# EAGLE design layer2 (EAGLE 9.6.2)
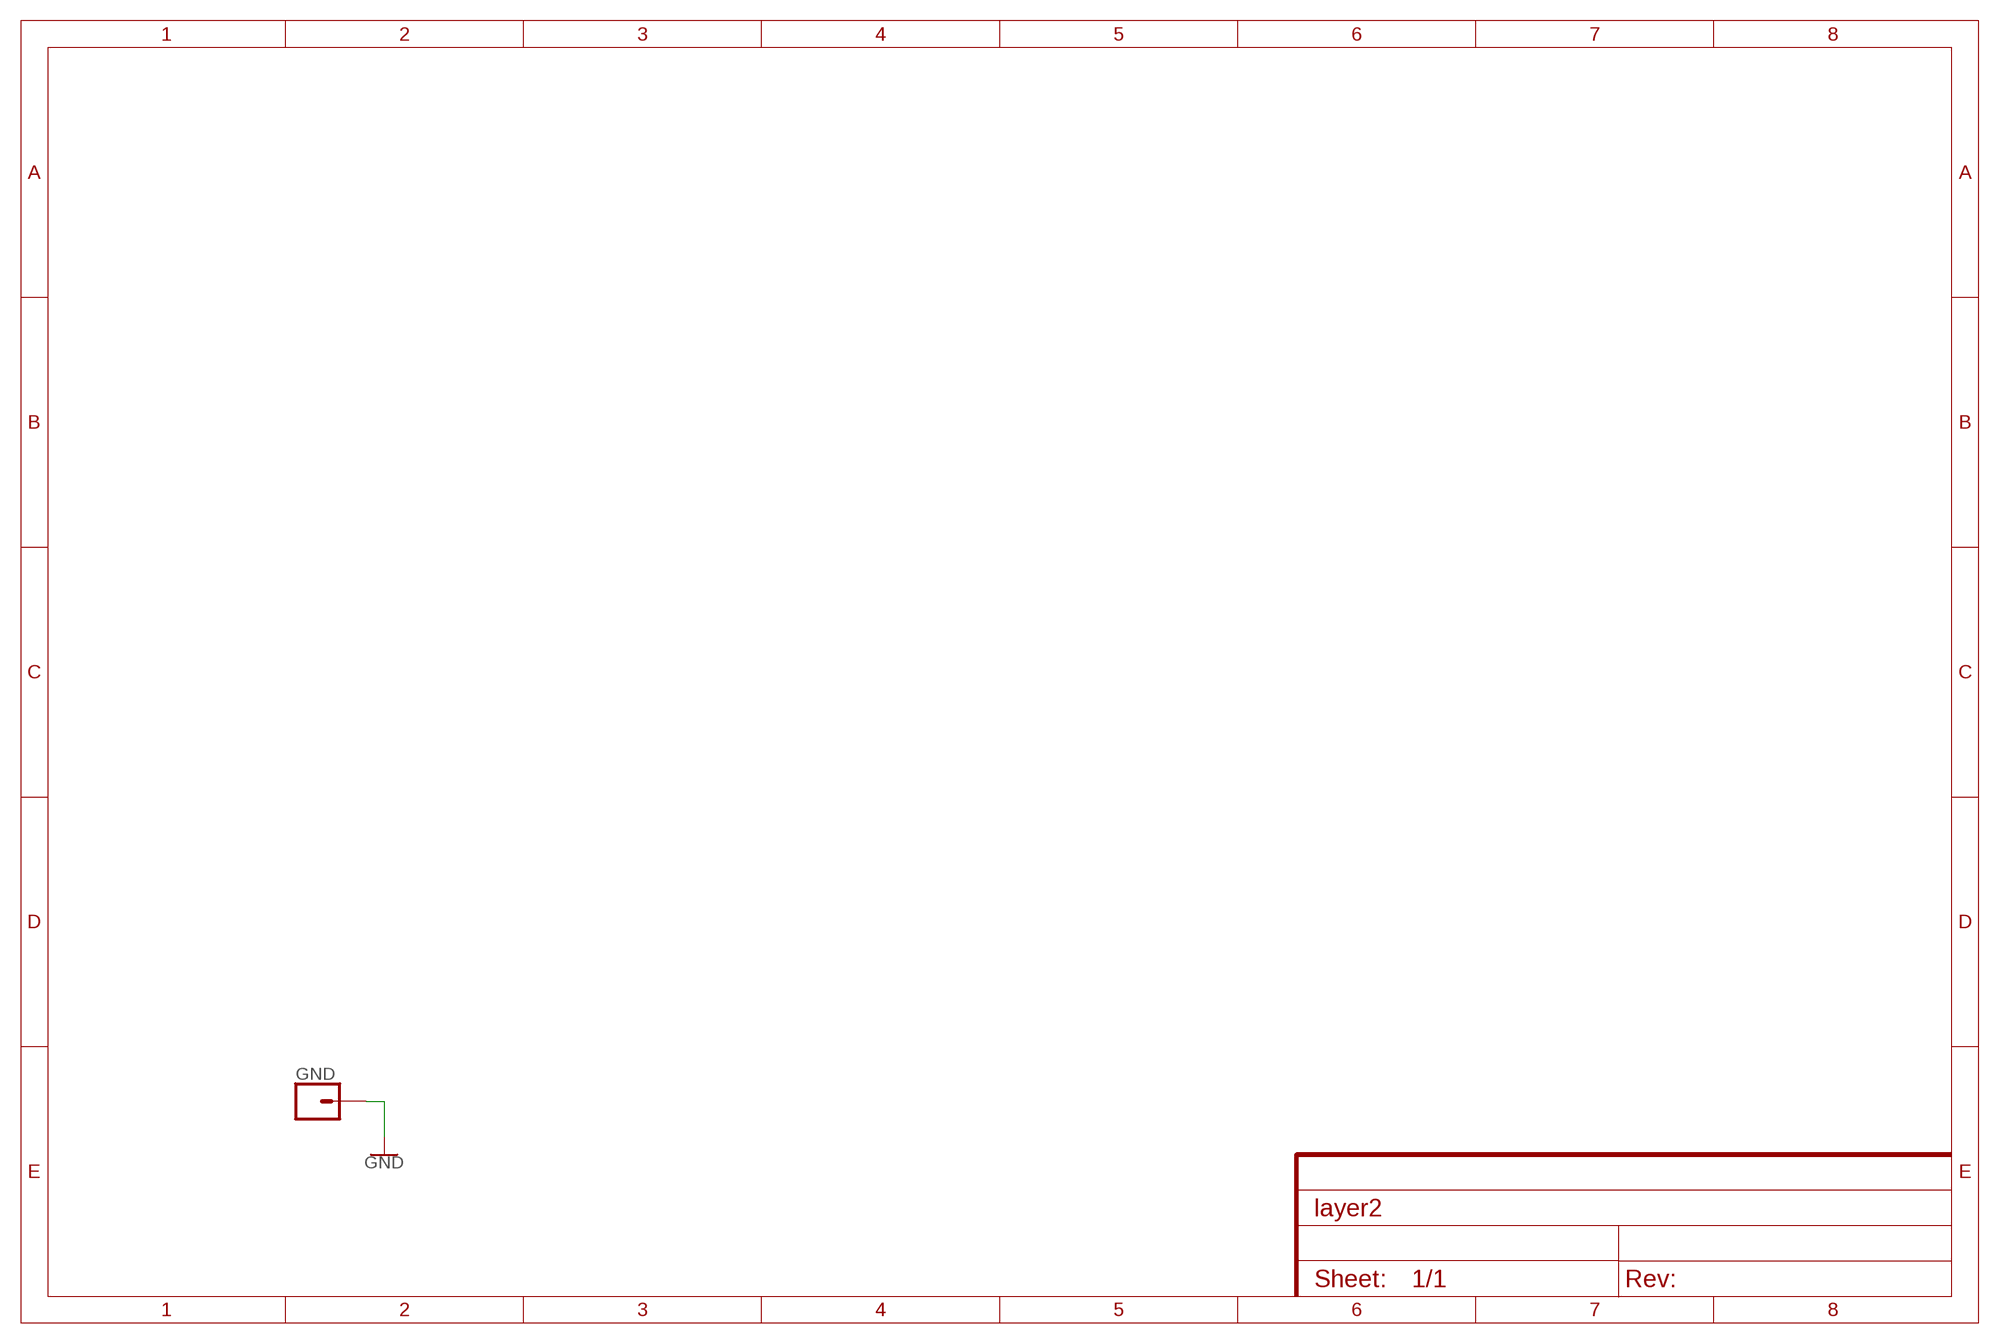
[diagram p0: schematic, sheet 1]

## Parts
GND  CONN_01  [1X01]

## Nets
GND: GND.1

## Library data of the parts
GND = SparkFun-Connectors:CONN_01: Single connection point. Often used as Generic Header-pin footprint for 0.1 inch spaced/style header connections On any of the 0.1 inch spaced packages, you can populate with these: Break Away Headers - Straight <https://www.sparkfun.com/products/116> (PRT-00116) Break Away Male Headers - Right Angle <https://www.sparkfun.com/products/553> (PRT-00553) Female Headers <https://www.sparkfun.com/products/115> (PRT-00115) Break Away Headers - Machine Pin <https://www.sparkfun.com/products/117> (PRT-00117) Break Away Female Headers - Swiss Machine Pin <https://www.sparkfun.com/products/743> (PRT-00743) This device is also useful as a general connection point to wire up your design to another part of your project. Our various solder wires solder well into these plated through hole pads. Hook-Up Wire - Assortment (Stranded, 22 AWG) <https://www.sparkfun.com/products/11375> (PRT-11375) Hook-Up Wire - Assortment (Solid Core, 22 AWG) <https://www.sparkfun.com/products/11367> (PRT-11367) View the entire wire category on our website here <https://www.sparkfun.com/categories/141> Special notes: SMTSO-256-ET is a "flush mount" nut for a 4-40 screw. We mostly use this on specialty testbeds; it is a nice way to connect hardware to your PCB at an adjustable hieght. Also note, the SNAP packages are for using a snappable style connector. We sell a baggie of snaps and they are also used on two LilyPad designs: Snap Assortment - 30 pack (male and female) <https://www.sparkfun.com/products/11347> (DEV-11347) LilyPad Arduino SimpleSnap <https://www.sparkfun.com/products/10941> (DEV-10941) LilyPad SimpleSnap Protoboard <https://www.sparkfun.com/products/10940> (DEV-10940)

## Board
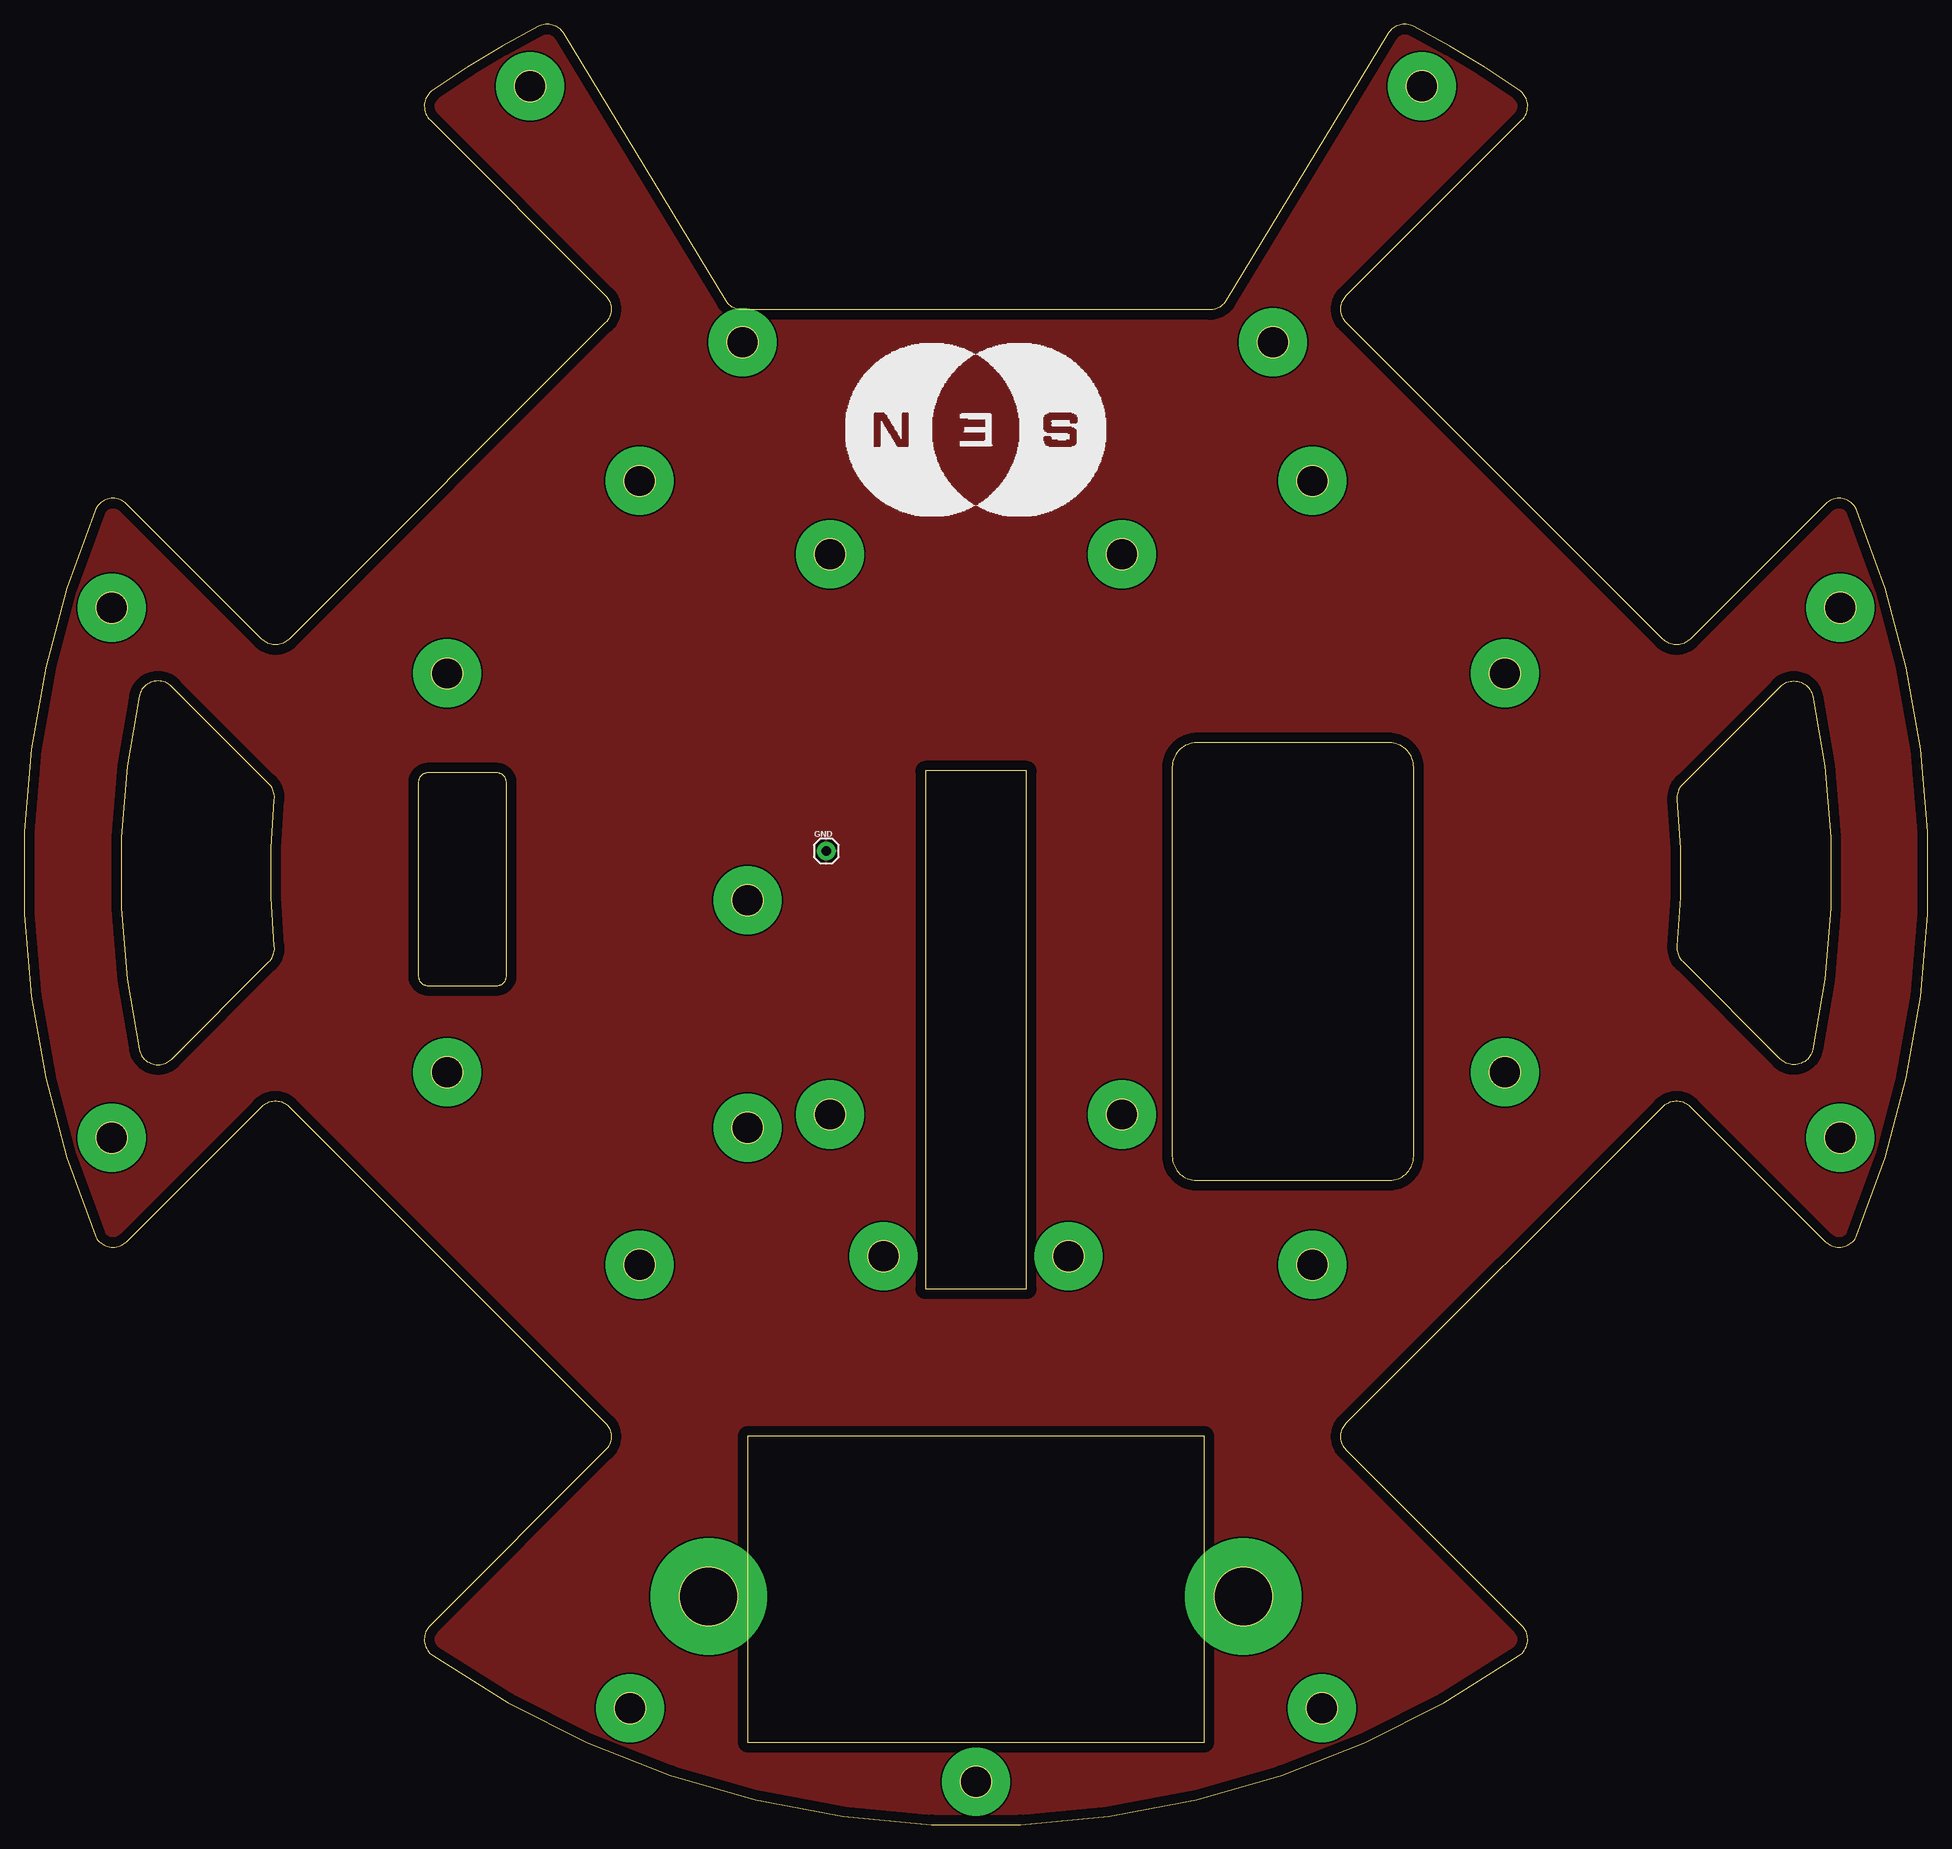
[diagram p1: board, top side]
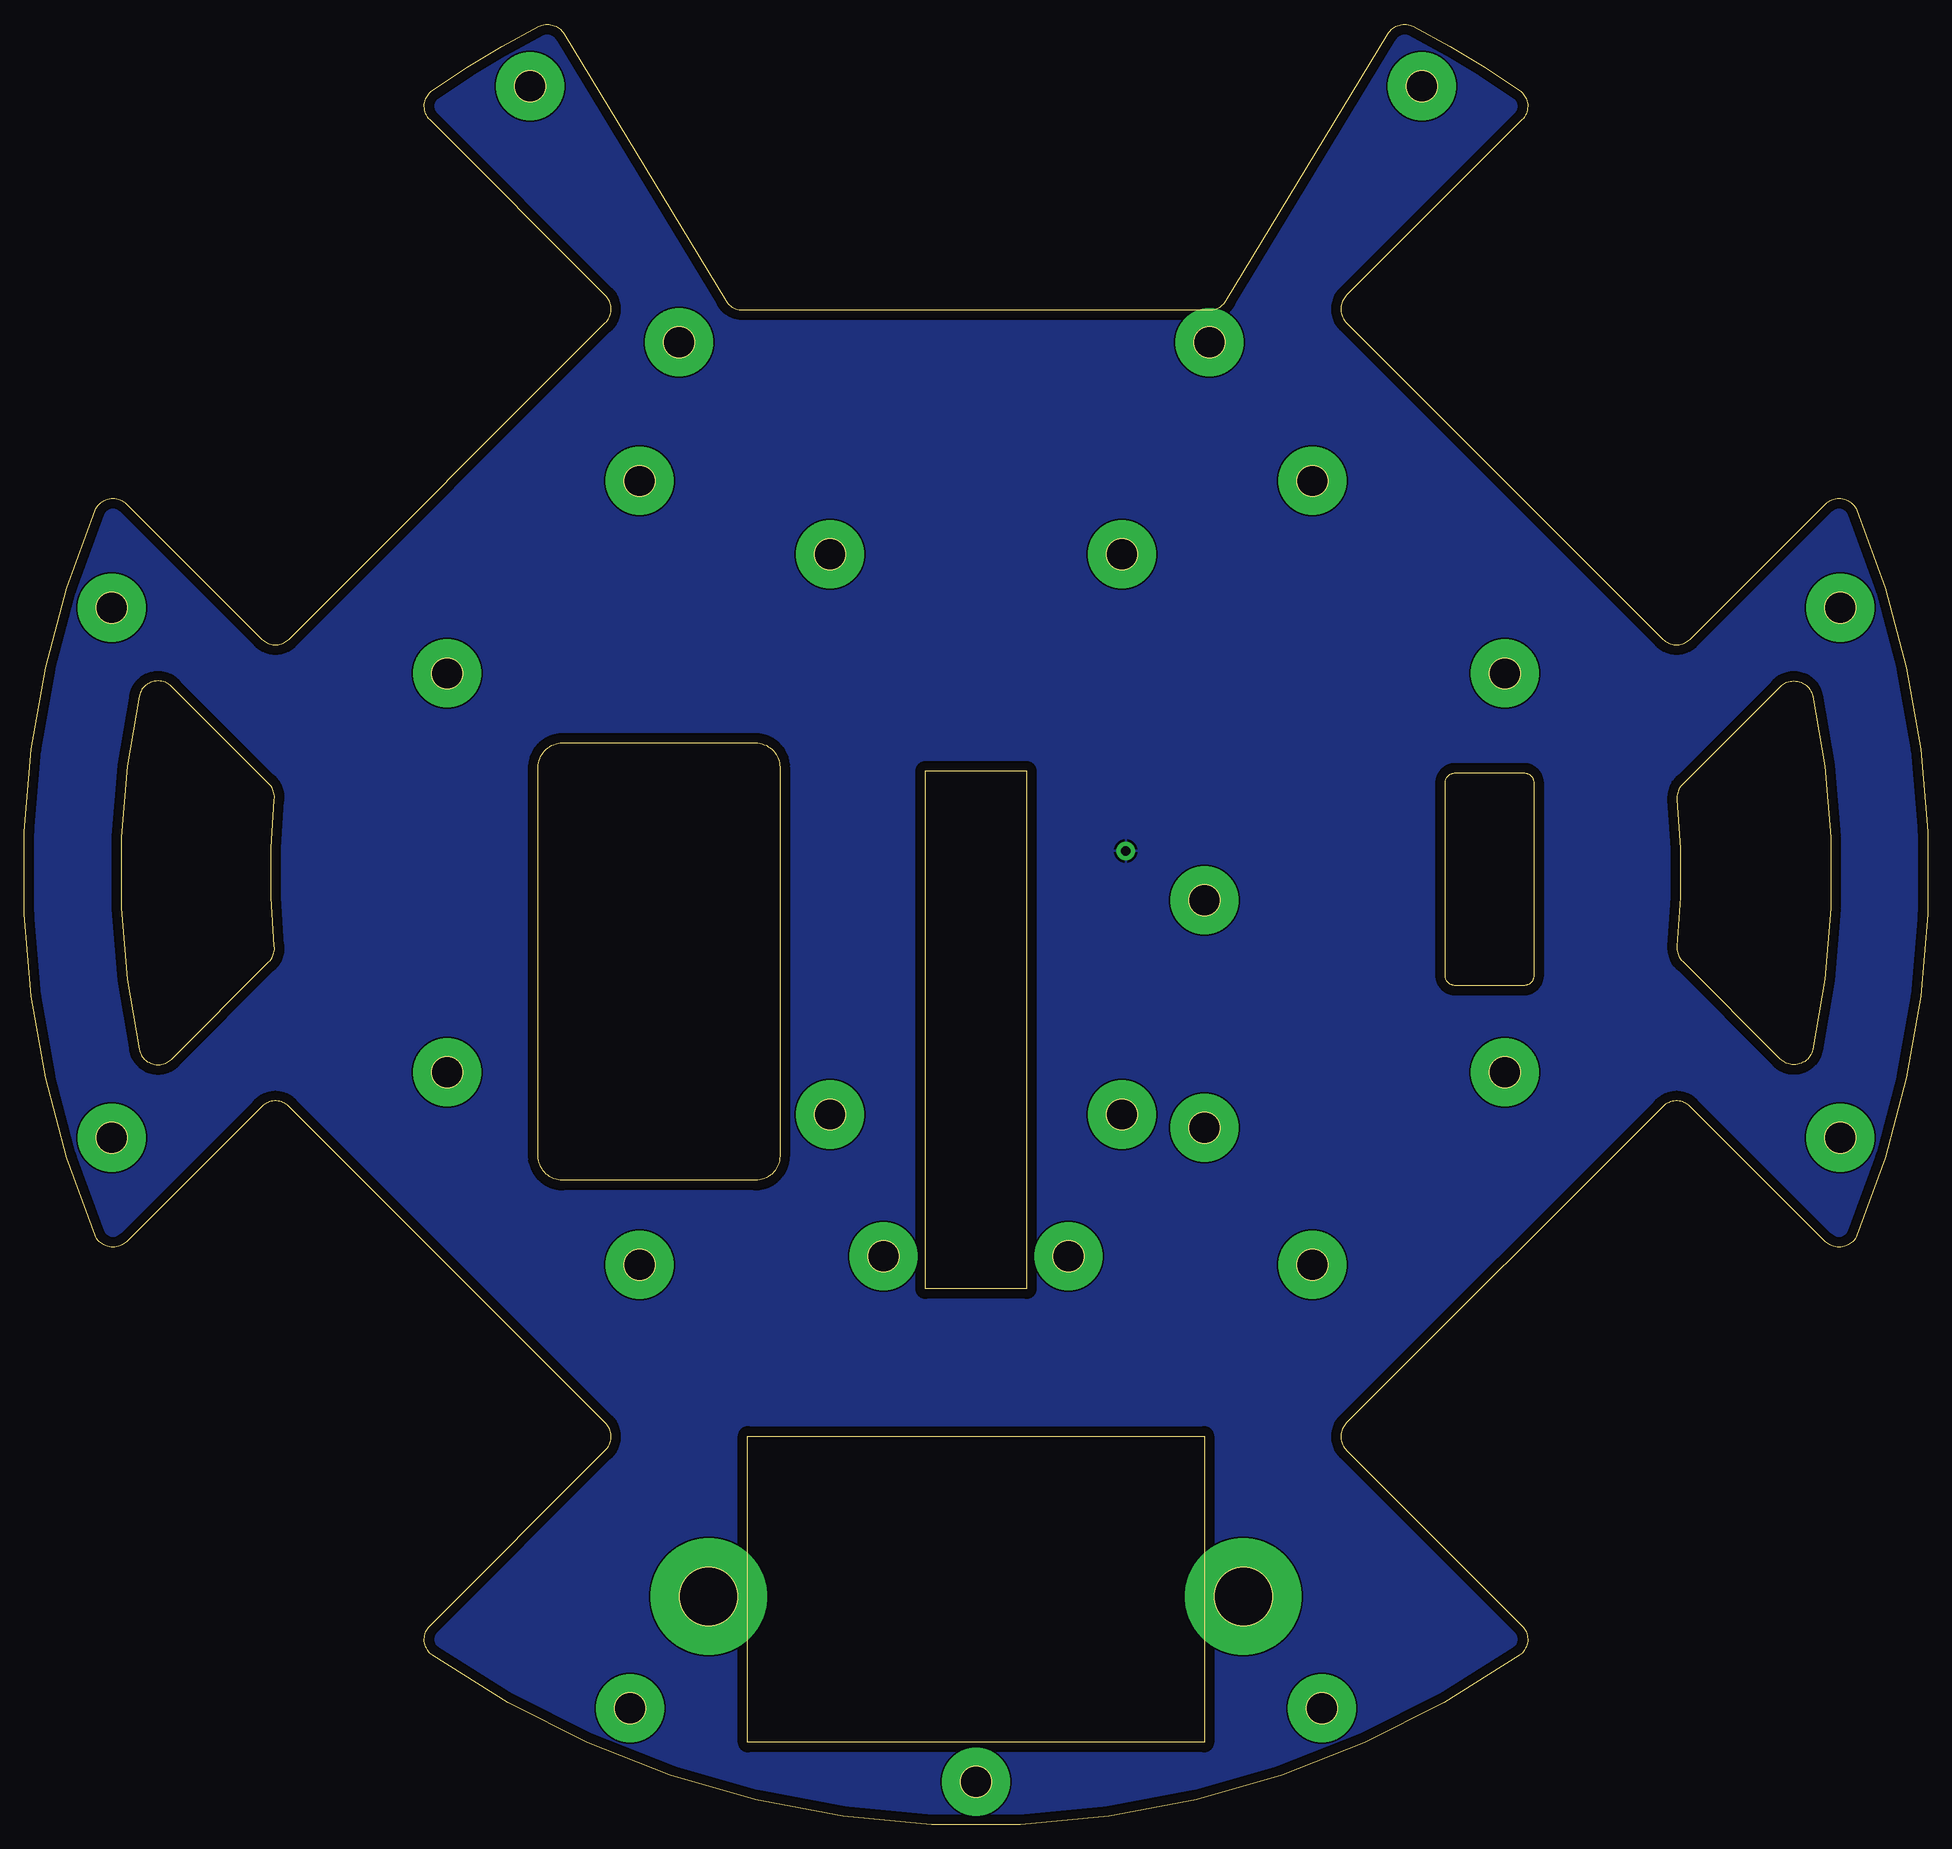
[diagram p2: board, bottom side, seen from below]

Size 195.82 x 185.17 mm. Coordinates in mm from the lower left corner, seen from the top.
Outline: 120.59,111.26 arc90 118.09,108.76
Outline: 118.09,68.76 arc90 120.59,66.26
Outline: 140.44,66.26 arc90 142.94,68.76
Outline: 142.94,108.76 arc90 140.44,111.26
Outline: 24.42,73.85 arc-90 27.25,73.85
Outline: 59.78,41.33 arc-90 59.78,38.5
Outline: 41.74,20.46 arc100 42.01,17.4
Outline: 42.01,17.4 arc70 153.81,17.4
Outline: 153.81,17.4 arc100 154.08,20.46
Outline: 136.04,38.5 arc-90 136.04,41.33
Outline: 168.57,73.85 arc-90 171.4,73.85
Outline: 185.28,59.97 arc113 188.54,60.62
Outline: 188.54,60.62 arc45 188.54,135.17
Outline: 188.54,135.17 arc113 185.28,135.82
Outline: 171.4,121.93 arc-90 168.57,121.93
Outline: 136.04,154.46 arc-90 136.04,157.29
Outline: 154.08,175.33 arc100 153.81,178.39
Outline: 153.81,178.39 arc7 142.92,184.94
Outline: 142.92,184.94 arc86 140.3,184.2
Outline: 123.64,156.75 arc-59 121.93,155.79
Outline: 73.89,155.79 arc-59 72.18,156.75
Outline: 55.52,184.2 arc86 52.89,184.94
Outline: 52.89,184.94 arc7 42.01,178.39
Outline: 42.01,178.39 arc100 41.74,175.33
Outline: 59.78,157.29 arc-90 59.78,154.46
Outline: 27.25,121.93 arc-90 24.42,121.93
Outline: 10.54,135.82 arc113 7.27,135.17
Outline: 7.27,135.17 arc45 7.27,60.62
Outline: 7.27,60.62 arc113 10.54,59.97
Outline: 25.16,88.73 arc51 25.73,90.35
Outline: 25.73,90.35 arc-12 25.73,105.44
Outline: 25.73,105.44 arc51 25.16,107.06
Outline: 15.17,117.04 arc123 11.8,116.04
Outline: 11.8,116.04 arc24 11.8,79.75
Outline: 11.8,79.75 arc123 15.17,78.75
Outline: 170.66,88.73 arc-51 170.09,90.35
Outline: 170.09,90.35 arc12 170.09,105.44
Outline: 170.09,105.44 arc-51 170.66,107.06
Outline: 180.65,117.04 arc-123 184.02,116.04
Outline: 184.02,116.04 arc-24 184.02,79.75
Outline: 184.02,79.75 arc-123 180.65,78.75
Outline: 41.53,108.17 arc90 40.53,107.17
Outline: 40.53,87.29 arc90 41.53,86.29
Outline: 48.61,86.29 arc90 49.61,87.29
Outline: 49.61,107.17 arc90 48.61,108.17
Outline: 140.44,111.26 120.59,111.26
Outline: 120.59,111.26 arc90 118.09,108.76
Outline: 118.09,108.76 118.09,68.76
Outline: 118.09,68.76 arc90 120.59,66.26
Outline: 120.59,66.26 140.44,66.26
Outline: 140.44,66.26 arc90 142.94,68.76
Outline: 142.94,68.76 142.94,108.76
Outline: 142.94,108.76 arc90 140.44,111.26
Outline: 10.54,59.97 24.42,73.85
Outline: 24.42,73.85 arc-90 27.25,73.85
Outline: 27.25,73.85 59.78,41.33
Outline: 59.78,41.33 arc-90 59.78,38.5
Outline: 59.78,38.5 41.74,20.46
Outline: 41.74,20.46 arc100 42.01,17.4
Outline: 42.01,17.4 arc70 153.81,17.4
Outline: 153.81,17.4 arc100 154.08,20.46
Outline: 154.08,20.46 136.04,38.5
Outline: 136.04,38.5 arc-90 136.04,41.33
Outline: 136.04,41.33 168.57,73.85
Outline: 168.57,73.85 arc-90 171.4,73.85
Outline: 171.4,73.85 185.28,59.97
Outline: 185.28,59.97 arc113 188.54,60.62
Outline: 188.54,60.62 arc45 188.54,135.17
Outline: 188.54,135.17 arc113 185.28,135.82
Outline: 185.28,135.82 171.4,121.93
Outline: 171.4,121.93 arc-90 168.57,121.93
Outline: 168.57,121.93 136.04,154.46
Outline: 136.04,154.46 arc-90 136.04,157.29
Outline: 136.04,157.29 154.08,175.33
Outline: 154.08,175.33 arc100 153.81,178.39
Outline: 153.81,178.39 arc7 142.92,184.94
Outline: 142.92,184.94 arc86 140.3,184.2
Outline: 140.3,184.2 123.64,156.75
Outline: 123.64,156.75 arc-59 121.93,155.79
Outline: 121.93,155.79 73.89,155.79
Outline: 73.89,155.79 arc-59 72.18,156.75
Outline: 72.18,156.75 55.52,184.2
Outline: 55.52,184.2 arc86 52.89,184.94
Outline: 52.89,184.94 arc7 42.01,178.39
Outline: 42.01,178.39 arc100 41.74,175.33
Outline: 41.74,175.33 59.78,157.29
Outline: 59.78,157.29 arc-90 59.78,154.46
Outline: 59.78,154.46 27.25,121.93
Outline: 27.25,121.93 arc-90 24.42,121.93
Outline: 24.42,121.93 10.54,135.82
Outline: 10.54,135.82 arc113 7.27,135.17
Outline: 7.27,135.17 arc45 7.27,60.62
Outline: 7.27,60.62 arc113 10.54,59.97
Outline: 25.16,88.73 arc51 25.73,90.35
Outline: 25.73,90.35 arc-12 25.73,105.44
Outline: 25.73,105.44 arc51 25.16,107.06
Outline: 25.16,107.06 15.17,117.04
Outline: 15.17,117.04 arc123 11.8,116.04
Outline: 11.8,116.04 arc24 11.8,79.75
Outline: 11.8,79.75 arc123 15.17,78.75
Outline: 15.17,78.75 25.16,88.73
Outline: 170.66,88.73 arc-51 170.09,90.35
Outline: 170.09,90.35 arc12 170.09,105.44
Outline: 170.09,105.44 arc-51 170.66,107.06
Outline: 170.66,107.06 180.65,117.04
Outline: 180.65,117.04 arc-123 184.02,116.04
Outline: 184.02,116.04 arc-24 184.02,79.75
Outline: 184.02,79.75 arc-123 180.65,78.75
Outline: 180.65,78.75 170.66,88.73
Outline: 48.61,108.17 41.53,108.17
Outline: 41.53,108.17 arc90 40.53,107.17
Outline: 40.53,107.17 40.53,87.29
Outline: 40.53,87.29 arc90 41.53,86.29
Outline: 41.53,86.29 48.61,86.29
Outline: 48.61,86.29 arc90 49.61,87.29
Outline: 49.61,87.29 49.61,107.17
Outline: 49.61,107.17 arc90 48.61,108.17
Outline: 103.11,55.09 103.11,108.39 92.71,108.39 92.71,55.09 103.11,55.09
Outline: 74.41,8.47 121.41,8.47 121.41,39.97 74.41,39.97 74.41,8.47
Outline: circle at 8.99,70.65 radius 1.6
Outline: circle at 8.99,125.14 radius 1.6
Outline: circle at 43.51,118.4 radius 1.6
Outline: circle at 43.51,77.39 radius 1.6
Outline: circle at 63.31,138.2 radius 1.6
Outline: circle at 52.05,178.8 radius 1.6
Outline: circle at 63.31,57.59 radius 1.6
Outline: circle at 62.32,11.97 radius 1.6
Outline: circle at 82.91,73.04 radius 1.6
Outline: circle at 82.91,130.67 radius 1.6
Outline: circle at 186.83,70.65 radius 1.6
Outline: circle at 186.83,125.14 radius 1.6
Outline: circle at 152.3,118.4 radius 1.6
Outline: circle at 152.3,77.39 radius 1.6
Outline: circle at 132.5,138.2 radius 1.6
Outline: circle at 143.77,178.8 radius 1.6
Outline: circle at 132.5,57.59 radius 1.6
Outline: circle at 133.5,11.97 radius 1.6
Outline: circle at 112.91,73.04 radius 1.6
Outline: circle at 112.91,130.67 radius 1.6
Copper layers (1*16): Top 0.035mm / dielectric 1.5mm / Bottom 0.035mm
Design rules "default": minimum track width 6mil, minimum drill 0.35mm, track to track 6mil, track to pad 6mil, pad to pad 6mil, via to via 6mil, smd to smd 6mil, copper to edge 40mil, drill to drill 6mil, minimum pad ring 10mil, minimum via ring 8mil, stop-mask expansion 4mil, vias tented up to drill 0mil, thermal gap 10mil

### Footprints (pad centres in the part's own frame; a part is rotated, then mirrored left to right if it is on the bottom)
1X01 = drill 1.016 pad 1.88: 1 0,0

### Placement (x,y rotation side)
GND  82.5,100.14 0 top

### Tracks (layer width: path | path; a pad name or v marks a point on that pad's centre or on a via)
GND
  pour Top: 95.2,194.12 -16.56,194.12 -16.56,88.71 -16.56,-12.89 102.82,-12.89 210.77,-12.89 210.77,92.52 210.77,194.12
  pour Bottom: -16.56,194.12 210.77,194.12 210.77,-12.89 -16.56,-12.89
N$1  (via drill 3.2 pad 7)
  other vias: 128.45,152.49
N$2  (via drill 3.2 pad 7)
  other vias: 82.91,130.67
N$3  (via drill 3.2 pad 7)
  other vias: 112.91,130.67
N$4  (via drill 3.2 pad 7)
  other vias: 132.5,138.2
N$5  (via drill 3.2 pad 7)
  other vias: 63.31,138.2
N$6  (via drill 3.2 pad 7)
  other vias: 73.91,152.49
N$7  (via drill 3.2 pad 7)
  other vias: 43.51,118.4
N$8  (via drill 3.2 pad 7)
  other vias: 74.41,95.09
N$9  (via drill 3.2 pad 7)
  other vias: 152.3,118.4
N$10  (via drill 3.2 pad 7)
  other vias: 186.83,125.14
N$11  (via drill 3.2 pad 7)
  other vias: 186.83,70.65
N$12  (via drill 3.2 pad 7)
  other vias: 152.3,77.39
N$13  (via drill 3.2 pad 7)
  other vias: 132.5,57.59
N$14  (via drill 3.2 pad 7)
  other vias: 112.91,73.04
N$15  (via drill 3.2 pad 7)
  other vias: 107.41,58.47
N$16  (via drill 3.2 pad 7)
  other vias: 88.41,58.47
N$17  (via drill 3.2 pad 7)
  other vias: 82.91,73.04
N$18  (via drill 3.2 pad 7)
  other vias: 74.41,71.69
N$19  (via drill 3.2 pad 7)
  other vias: 43.51,77.39
N$20  (via drill 3.2 pad 7)
  other vias: 63.31,57.59
N$21  (via drill 3.2 pad 7)
  other vias: 8.99,125.14
N$22  (via drill 3.2 pad 7)
  other vias: 8.99,70.65
N$23  (via drill 3.2 pad 7)
  other vias: 62.32,11.97
N$24  (via drill 3.2 pad 7)
  other vias: 97.91,4.39
N$25  (via drill 3.2 pad 7)
  other vias: 133.5,11.97
N$26  (via drill 3.2 pad 7)
  other vias: 52.05,178.8
N$27  (via drill 3.2 pad 7)
  other vias: 143.77,178.8
N$28  (via drill 6 pad 12)
  other vias: 70.41,23.47
N$29  (via drill 6 pad 12)
  other vias: 125.41,23.47